# Altium schematic sheet Power-LED.SchDoc: =ProjectTitle
size 297 x 209 mm; Address1: Address1; Address2: Address2; Address3: Address3; Address4: Address4; SheetNumber: 7; SheetTotal: 7; Scale: 1:1; DocumentType: Схема электрическая принципиальная
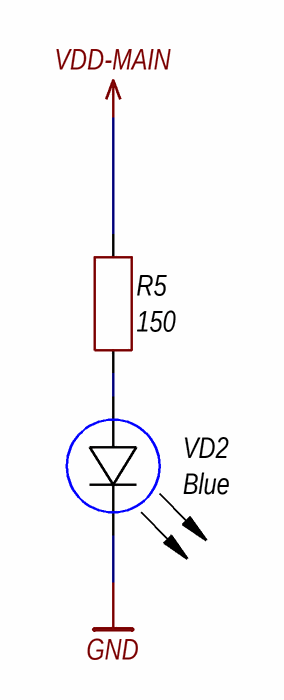
[diagram p0: Power-LED.SchDoc]

## Parts
R5  150  [CH0402R]
VD2  Blue  [CH0402LG]

## Nets
GND: VD2.2(C)
VDD-MAIN: R5.2
NetR5_1: R5.1 VD2.1(A)

## Notes on the sheet
- Изм.
- Лист
- № докум.
- Подп.
- Дата
- Копировал
- Формат А4

## Library data of the parts
R5 = Resistor: Manufacturer: *; Model: *; HelpURL: *; ComponentKind: *; Value: 150
VD2 = LED: Manufacturer: *; Model: *; HelpURL: *; ComponentKind: *; Value: Blue